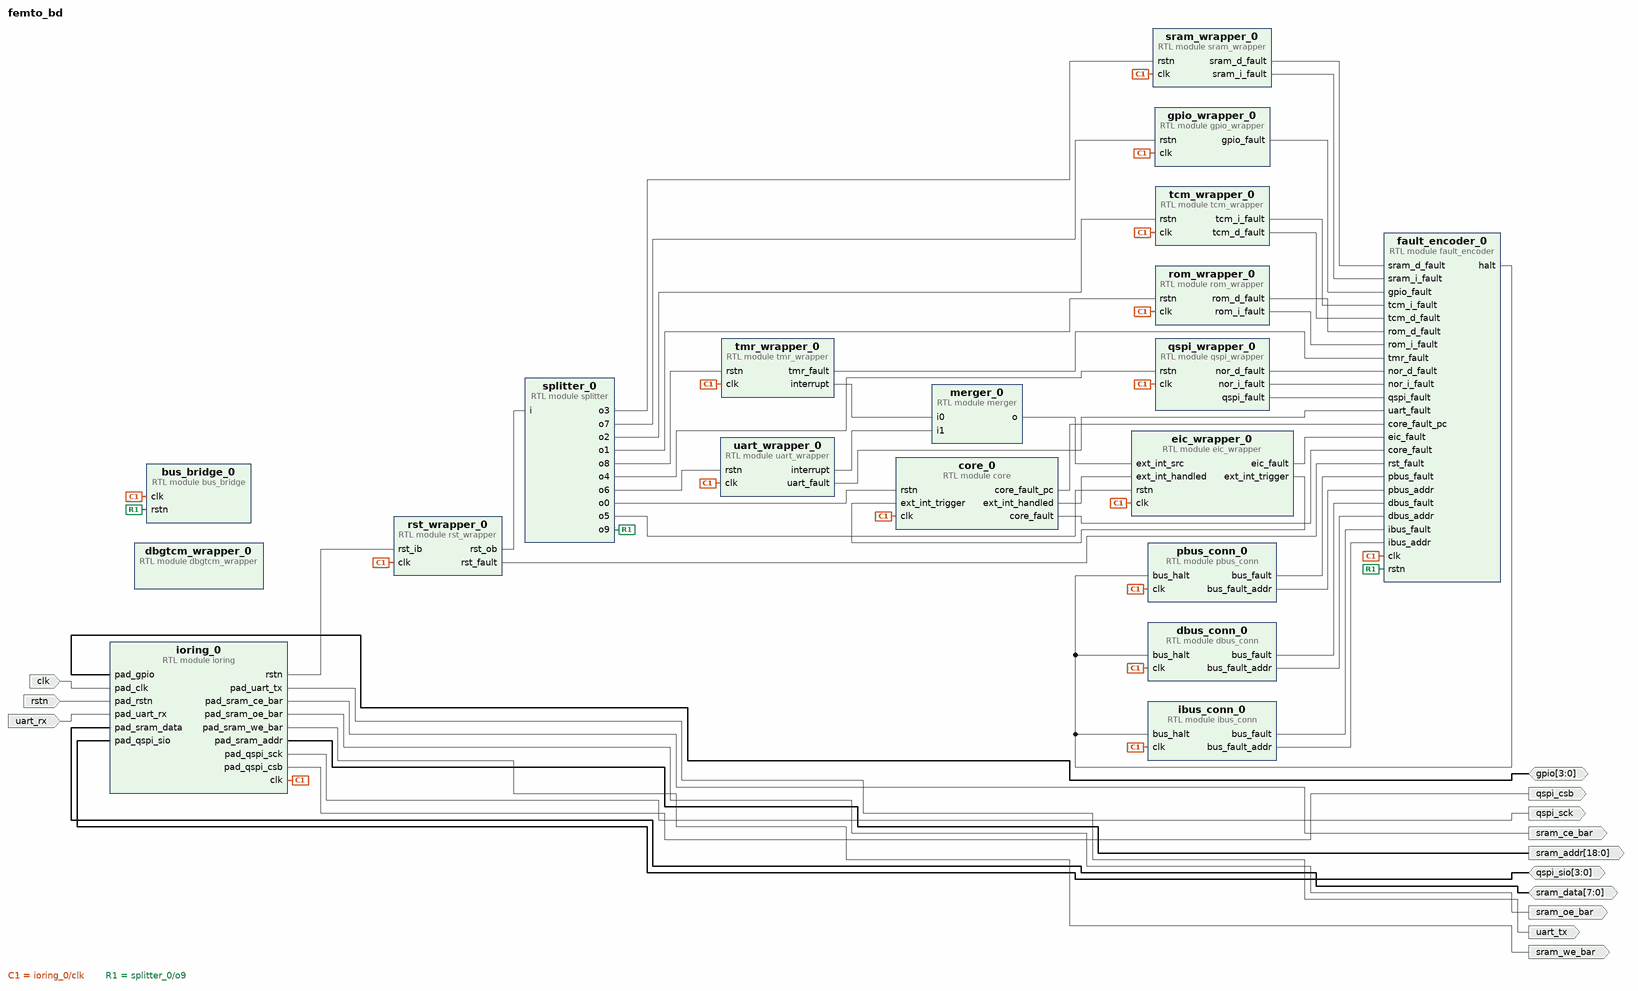
[diagram p0: block diagram of the top level]
# Vivado block design femto_bd, xc7a35tcpg236-1, Vivado 2018.2
create_bd_design femto_bd

create_bd_port -dir I clk
create_bd_port -dir I rstn
create_bd_port -dir I uart_rx
create_bd_port -dir IO -from 3 -to 0 gpio
create_bd_port -dir O uart_tx
create_bd_port -dir O sram_ce_bar
create_bd_port -dir O sram_oe_bar
create_bd_port -dir O sram_we_bar
create_bd_port -dir IO -from 7 -to 0 sram_data
create_bd_port -dir O -from 18 -to 0 sram_addr
create_bd_port -dir O qspi_sck
create_bd_port -dir O qspi_csb
create_bd_port -dir IO -from 3 -to 0 qspi_sio

create_bd_cell -type module -reference merger merger_0
create_bd_cell -type module -reference splitter splitter_0
create_bd_cell -type module -reference qspi_wrapper qspi_wrapper_0
create_bd_cell -type module -reference core core_0
create_bd_cell -type module -reference ioring ioring_0
create_bd_cell -type module -reference rom_wrapper rom_wrapper_0
create_bd_cell -type module -reference sram_wrapper sram_wrapper_0
create_bd_cell -type module -reference eic_wrapper eic_wrapper_0
create_bd_cell -type module -reference tcm_wrapper tcm_wrapper_0
create_bd_cell -type module -reference fault_encoder fault_encoder_0
create_bd_cell -type module -reference rst_wrapper rst_wrapper_0
create_bd_cell -type module -reference gpio_wrapper gpio_wrapper_0
create_bd_cell -type module -reference tmr_wrapper tmr_wrapper_0
create_bd_cell -type module -reference uart_wrapper uart_wrapper_0
create_bd_cell -type module -reference bus_bridge bus_bridge_0
create_bd_cell -type module -reference dbus_conn dbus_conn_0
create_bd_cell -type module -reference ibus_conn ibus_conn_0
create_bd_cell -type module -reference pbus_conn pbus_conn_0
create_bd_cell -type module -reference dbgtcm_wrapper dbgtcm_wrapper_0

# ---- connections ----

connect_bd_net [get_bd_pins ioring_0/clk] \
  [get_bd_pins qspi_wrapper_0/clk] [get_bd_pins core_0/clk] [get_bd_pins rom_wrapper_0/clk] [get_bd_pins sram_wrapper_0/clk] \
  [get_bd_pins eic_wrapper_0/clk] [get_bd_pins tcm_wrapper_0/clk] [get_bd_pins fault_encoder_0/clk] \
  [get_bd_pins rst_wrapper_0/clk] [get_bd_pins gpio_wrapper_0/clk] [get_bd_pins tmr_wrapper_0/clk] \
  [get_bd_pins uart_wrapper_0/clk] [get_bd_pins bus_bridge_0/clk] [get_bd_pins dbus_conn_0/clk] [get_bd_pins ibus_conn_0/clk] \
  [get_bd_pins pbus_conn_0/clk]
connect_bd_net [get_bd_pins ioring_0/rstn] [get_bd_pins rst_wrapper_0/rst_ib]
connect_bd_net [get_bd_pins rst_wrapper_0/rst_ob] [get_bd_pins splitter_0/i]
connect_bd_net [get_bd_pins splitter_0/o0] [get_bd_pins core_0/rstn]
connect_bd_net [get_bd_pins splitter_0/o1] [get_bd_pins rom_wrapper_0/rstn]
connect_bd_net [get_bd_pins splitter_0/o2] [get_bd_pins tcm_wrapper_0/rstn]
connect_bd_net [get_bd_pins splitter_0/o3] [get_bd_pins sram_wrapper_0/rstn]
connect_bd_net [get_bd_pins splitter_0/o4] [get_bd_pins qspi_wrapper_0/rstn]
connect_bd_net [get_bd_pins splitter_0/o5] [get_bd_pins eic_wrapper_0/rstn]
connect_bd_net [get_bd_pins splitter_0/o6] [get_bd_pins uart_wrapper_0/rstn]
connect_bd_net [get_bd_pins splitter_0/o7] [get_bd_pins gpio_wrapper_0/rstn]
connect_bd_net [get_bd_pins splitter_0/o8] [get_bd_pins tmr_wrapper_0/rstn]
connect_bd_net [get_bd_pins splitter_0/o9] [get_bd_pins fault_encoder_0/rstn] [get_bd_pins bus_bridge_0/rstn]
connect_bd_net [get_bd_pins rst_wrapper_0/rst_fault] [get_bd_pins fault_encoder_0/rst_fault]
connect_bd_net [get_bd_pins eic_wrapper_0/ext_int_trigger] [get_bd_pins core_0/ext_int_trigger]
connect_bd_net [get_bd_pins merger_0/o] [get_bd_pins eic_wrapper_0/ext_int_src]
connect_bd_net [get_bd_pins core_0/ext_int_handled] [get_bd_pins eic_wrapper_0/ext_int_handled]
connect_bd_net [get_bd_pins uart_wrapper_0/interrupt] [get_bd_pins merger_0/i1]
connect_bd_net [get_bd_pins tmr_wrapper_0/interrupt] [get_bd_pins merger_0/i0]
connect_bd_net [get_bd_pins tmr_wrapper_0/tmr_fault] [get_bd_pins fault_encoder_0/tmr_fault]
connect_bd_net [get_bd_pins uart_wrapper_0/uart_fault] [get_bd_pins fault_encoder_0/uart_fault]
connect_bd_net [get_bd_pins core_0/core_fault_pc] [get_bd_pins fault_encoder_0/core_fault_pc]
connect_bd_net [get_bd_pins core_0/core_fault] [get_bd_pins fault_encoder_0/core_fault]
connect_bd_net [get_bd_pins eic_wrapper_0/eic_fault] [get_bd_pins fault_encoder_0/eic_fault]
connect_bd_net [get_bd_pins dbus_conn_0/bus_fault] [get_bd_pins fault_encoder_0/dbus_fault]
connect_bd_net [get_bd_pins ibus_conn_0/bus_fault] [get_bd_pins fault_encoder_0/ibus_fault]
connect_bd_net [get_bd_pins pbus_conn_0/bus_fault] [get_bd_pins fault_encoder_0/pbus_fault]
connect_bd_net [get_bd_pins sram_wrapper_0/sram_d_fault] [get_bd_pins fault_encoder_0/sram_d_fault]
connect_bd_net [get_bd_pins sram_wrapper_0/sram_i_fault] [get_bd_pins fault_encoder_0/sram_i_fault]
connect_bd_net [get_bd_pins rom_wrapper_0/rom_d_fault] [get_bd_pins fault_encoder_0/rom_d_fault]
connect_bd_net [get_bd_pins rom_wrapper_0/rom_i_fault] [get_bd_pins fault_encoder_0/rom_i_fault]
connect_bd_net [get_bd_pins qspi_wrapper_0/nor_d_fault] [get_bd_pins fault_encoder_0/nor_d_fault]
connect_bd_net [get_bd_pins qspi_wrapper_0/nor_i_fault] [get_bd_pins fault_encoder_0/nor_i_fault]
connect_bd_net [get_bd_pins qspi_wrapper_0/qspi_fault] [get_bd_pins fault_encoder_0/qspi_fault]
connect_bd_net [get_bd_pins gpio_wrapper_0/gpio_fault] [get_bd_pins fault_encoder_0/gpio_fault]
connect_bd_net [get_bd_pins tcm_wrapper_0/tcm_i_fault] [get_bd_pins fault_encoder_0/tcm_i_fault]
connect_bd_net [get_bd_pins tcm_wrapper_0/tcm_d_fault] [get_bd_pins fault_encoder_0/tcm_d_fault]
connect_bd_net -net pad_clk_0_1 [get_bd_ports clk] [get_bd_pins ioring_0/pad_clk]
connect_bd_net -net pad_rstn_0_1 [get_bd_ports rstn] [get_bd_pins ioring_0/pad_rstn]
connect_bd_net -net pad_uart_rx_0_1 [get_bd_ports uart_rx] [get_bd_pins ioring_0/pad_uart_rx]
connect_bd_net [get_bd_ports gpio] [get_bd_pins ioring_0/pad_gpio]
connect_bd_net [get_bd_pins ioring_0/pad_uart_tx] [get_bd_ports uart_tx]
connect_bd_net [get_bd_pins ioring_0/pad_sram_ce_bar] [get_bd_ports sram_ce_bar]
connect_bd_net [get_bd_pins ioring_0/pad_sram_oe_bar] [get_bd_ports sram_oe_bar]
connect_bd_net [get_bd_pins ioring_0/pad_sram_we_bar] [get_bd_ports sram_we_bar]
connect_bd_net [get_bd_ports sram_data] [get_bd_pins ioring_0/pad_sram_data]
connect_bd_net [get_bd_pins ioring_0/pad_sram_addr] [get_bd_ports sram_addr]
connect_bd_net [get_bd_pins ioring_0/pad_qspi_sck] [get_bd_ports qspi_sck]
connect_bd_net [get_bd_pins ioring_0/pad_qspi_csb] [get_bd_ports qspi_csb]
connect_bd_net [get_bd_ports qspi_sio] [get_bd_pins ioring_0/pad_qspi_sio]
connect_bd_net [get_bd_pins dbus_conn_0/bus_fault_addr] [get_bd_pins fault_encoder_0/dbus_addr]
connect_bd_net [get_bd_pins pbus_conn_0/bus_fault_addr] [get_bd_pins fault_encoder_0/pbus_addr]
connect_bd_net [get_bd_pins ibus_conn_0/bus_fault_addr] [get_bd_pins fault_encoder_0/ibus_addr]
connect_bd_net [get_bd_pins fault_encoder_0/halt] \
  [get_bd_pins dbus_conn_0/bus_halt] [get_bd_pins ibus_conn_0/bus_halt] [get_bd_pins pbus_conn_0/bus_halt]

validate_bd_design
save_bd_design
